# EAGLE design Tic-tac-toe game (EAGLE 9.6.2)
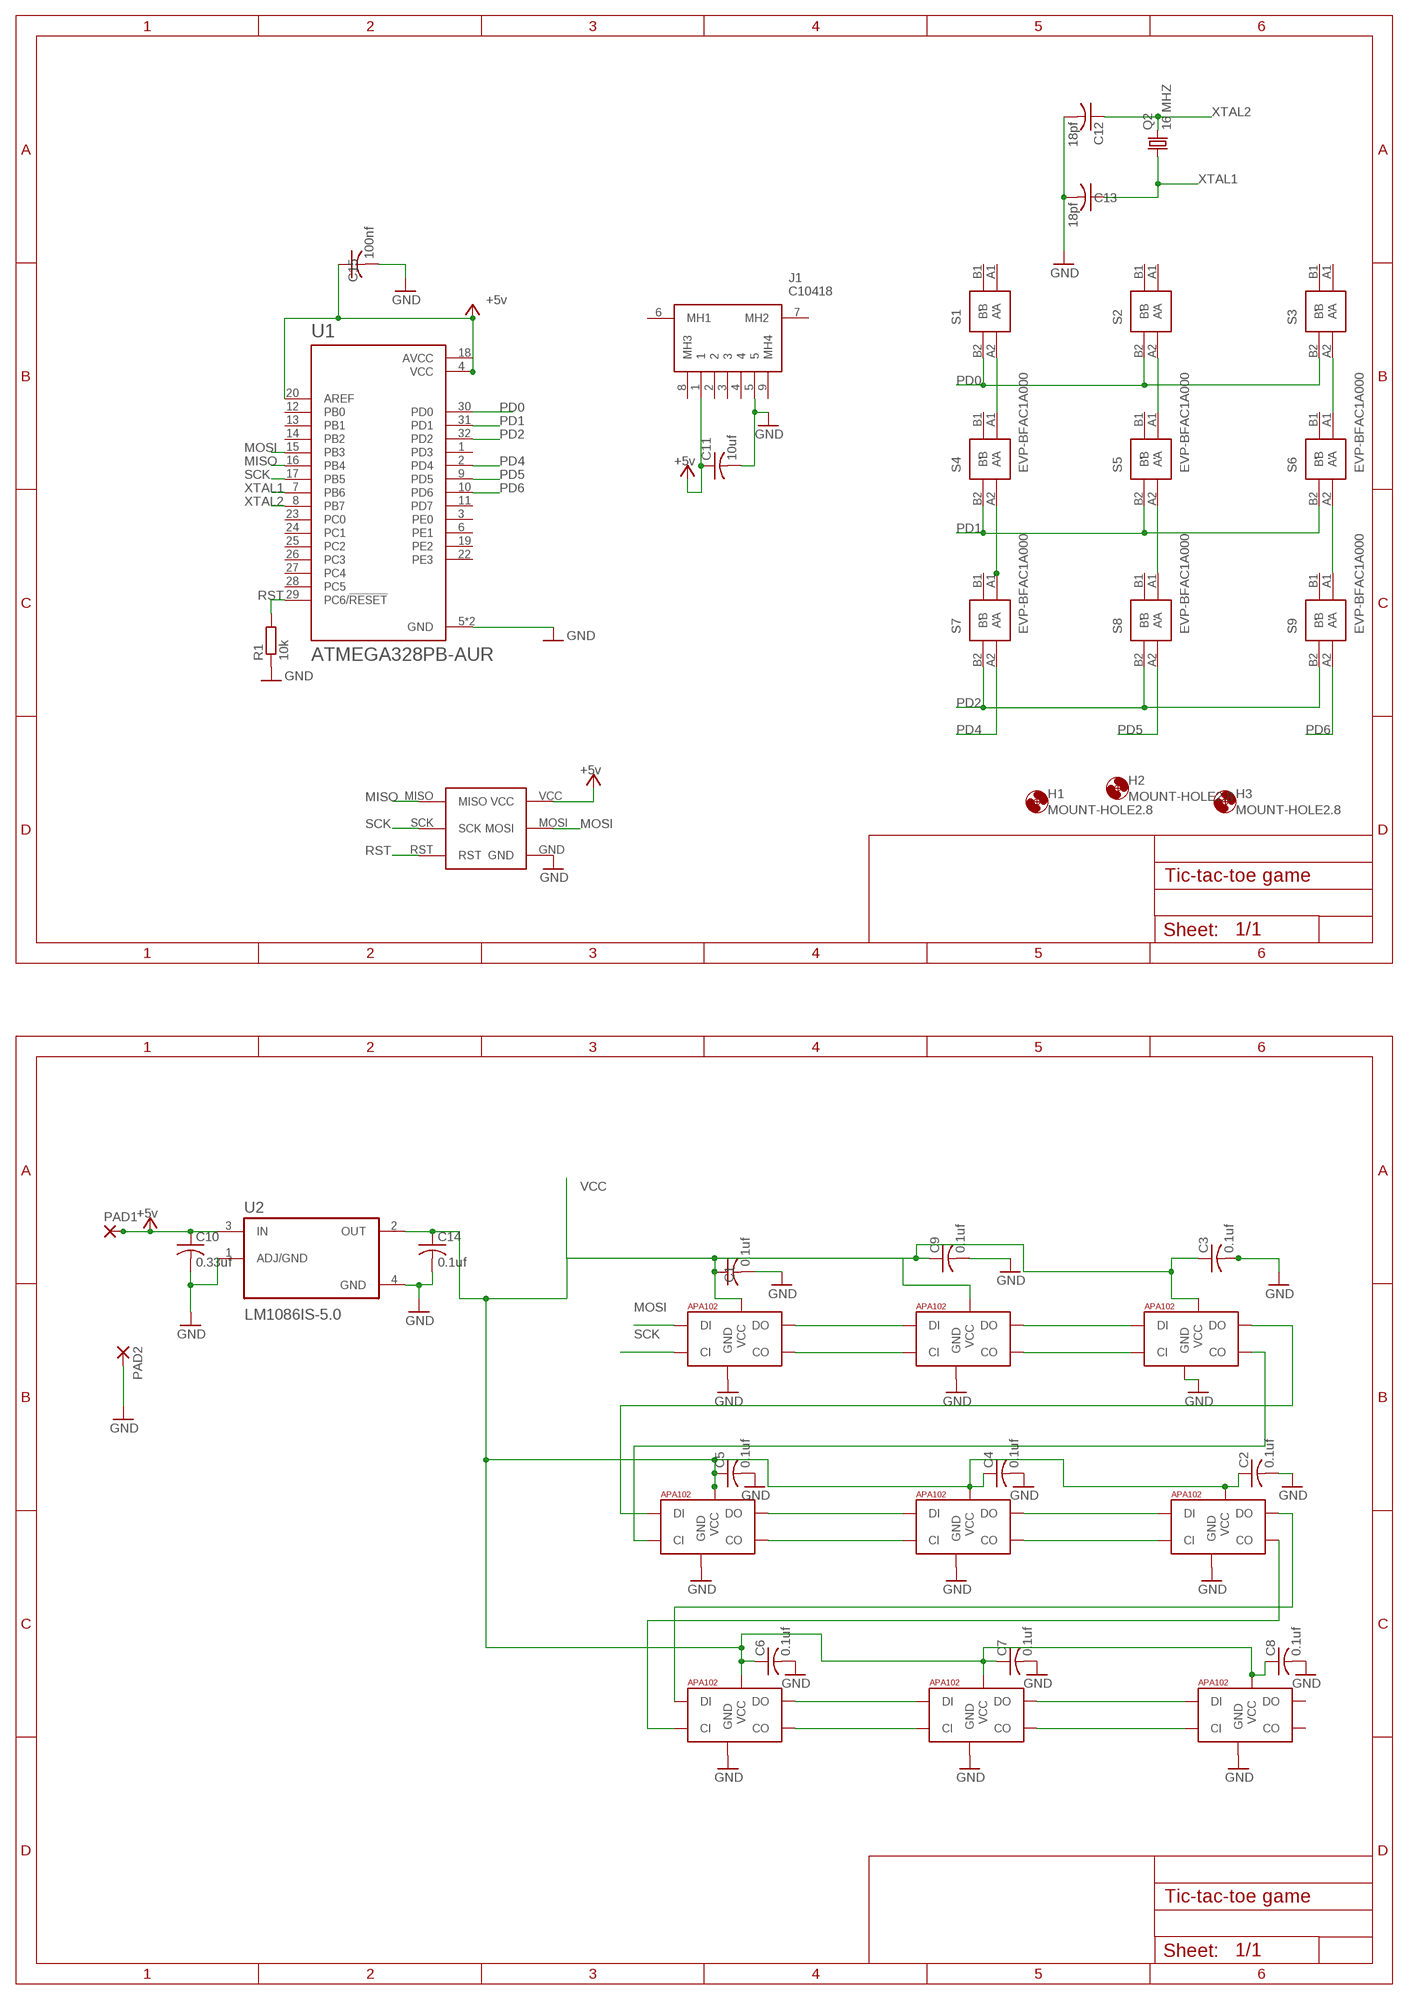
[diagram p0: schematic, sheet 1]

## Parts
C1  0.1uf  C-USC0805  [C0805]
C2  0.1uf  C-USC0805  [C0805]
C3  0.1uf  C-USC0805  [C0805]
C4  0.1uf  C-USC0805  [C0805]
C5  0.1uf  C-USC0805  [C0805]
C6  0.1uf  C-USC0805  [C0805]
C7  0.1uf  C-USC0805  [C0805]
C8  0.1uf  C-USC0805  [C0805]
C9  0.1uf  C-USC0805  [C0805]
C10  0.33uf  C-USC0805  [C0805]
C11  10uf  C-USC0805  [C0805]
C12  18pf  C-USC0805  [C0805]
C13  18pf  C-USC0805  [C0805]
C14  0.1uf  C-USC0805  [C0805]
C15  100nf  C-USC0805  [C0805]
H1  MOUNT-HOLE2.8  [2,8]
H2  MOUNT-HOLE2.8  [2,8]
H3  MOUNT-HOLE2.8  [2,8]
J1  C10418  [C10418]
PAD1  2,15/1,0  [2,15/1,0]
PAD2  2,15/1,0  [2,15/1,0]
Q2  16 MHZ  CRYSTALHC49UP  [HC49UP]
R1  10k  R-EU_M0805  [M0805]
S1  EVP-BFAC1A000  [EVPBFAC1A000]
S2  EVP-BFAC1A000  [EVPBFAC1A000]
S3  EVP-BFAC1A000  [EVPBFAC1A000]
S4  EVP-BFAC1A000  [EVPBFAC1A000]
S5  EVP-BFAC1A000  [EVPBFAC1A000]
S6  EVP-BFAC1A000  [EVPBFAC1A000]
S7  EVP-BFAC1A000  [EVPBFAC1A000]
S8  EVP-BFAC1A000  [EVPBFAC1A000]
S9  EVP-BFAC1A000  [EVPBFAC1A000]
U1  ATMEGA328PB-AUR  [QFP80P900X900X120-32N]
U2  LM1086IS-5.0  [TO254P1524X483-4N]
U$1  AVR-ISP  [AVR-ISP]
U$2  APA1025050  [APA102_5050]
U$3  APA1025050  [APA102_5050]
U$4  APA1025050  [APA102_5050]
U$5  APA1025050  [APA102_5050]
U$6  APA1025050  [APA102_5050]
U$7  APA1025050  [APA102_5050]
U$8  APA1025050  [APA102_5050]
U$9  APA1025050  [APA102_5050]
U$10  APA1025050  [APA102_5050]

## Nets
GND: C1.2 C2.2 C3.2 C4.2 C5.2 C6.2 C7.2 C8.2 C9.2 C10.2 C11.2 C12.2 C13.2 C14.2 C15.2 J1.5 PAD2.1(P) R1.1 U1.5(GND) U1.21(GND) U2.1(ADJ/GND) U2.4(GND) U$1.GND U$2.6(GND) U$3.6(GND) U$4.6(GND) U$5.6(GND) U$6.6(GND) U$7.6(GND) U$8.6(GND) U$9.6(GND) U$10.6(GND)
MISO: U1.16(PB4) U$1.MISO
MOSI: U1.15(PB3) U$1.MOSI U$2.4(DI)
N$4: C10.1 PAD1.1(P) U2.3(IN) ; supply symbol labelled +5v
N$5: U$2.3(DO) U$3.4(DI)
N$6: U$2.2(CO) U$3.5(CI)
N$7: U$3.3(DO) U$4.4(DI)
N$8: U$3.2(CO) U$4.5(CI)
N$11: U$8.3(DO) U$9.4(DI)
N$15: S1.A2(A') S4.A1(A)
N$16: S6.A2(A') S9.A1(A)
N$19: S4.A2(A') S7.A1(A)
N$23: S2.A2(A') S5.A1(A)
N$24: S5.A2(A') S8.A1(A)
N$26: S3.A2(A') S6.A1(A)
N$34: U$4.3(DO) U$5.4(DI)
N$35: U$4.2(CO) U$5.5(CI)
N$36: U$5.3(DO) U$6.4(DI)
N$37: U$5.2(CO) U$6.5(CI)
N$38: U$6.3(DO) U$7.4(DI)
N$39: U$6.2(CO) U$7.5(CI)
N$40: U$8.2(CO) U$9.5(CI)
N$41: U$9.3(DO) U$10.4(DI)
N$42: U$9.2(CO) U$10.5(CI)
N$46: U$7.2(CO) U$8.5(CI)
N$47: U$7.3(DO) U$8.4(DI)
PD0: S1.B2(B') S2.B2(B') S3.B2(B') U1.30(PD0)
PD1: S4.B2(B') S5.B2(B') S6.B2(B') U1.31(PD1)
PD2: S7.B2(B') S8.B2(B') S9.B2(B') U1.32(PD2)
PD4: S7.A2(A') U1.2(PD4)
PD5: S8.A2(A') U1.9(PD5)
PD6: S9.A2(A') U1.10(PD6)
RST: R1.2 U1.29(PC6/!RESET) U$1.RST
SCK: U1.17(PB5) U$1.SCK U$2.5(CI)
VCC: C1.1 C2.1 C3.1 C4.1 C5.1 C6.1 C7.1 C8.1 C9.1 C11.1 C14.1 C15.1 J1.1 U1.4(VCC) U1.18(AVCC) U1.20(AREF) U2.2(OUT) U$1.VCC U$2.1(VCC) U$3.1(VCC) U$4.1(VCC) U$5.1(VCC) U$6.1(VCC) U$7.1(VCC) U$8.1(VCC) U$9.1(VCC) U$10.1(VCC) ; supply symbol labelled +5v
XTAL1: C13.1 Q2.1 U1.7(PB6)
XTAL2: C12.1 Q2.2 U1.8(PB7)
Unconnected: J1.2 J1.3 J1.4 J1.6(MH1) J1.7(MH2) J1.8(MH3) J1.9(MH4) S1.A1(A) S1.B1(B) S2.A1(A) S2.B1(B) S3.A1(A) S3.B1(B) S4.B1(B) S5.B1(B) S6.B1(B) S7.B1(B) S8.B1(B) S9.B1(B) U1.1(PD3) U1.3(PE0) U1.6(PE1) U1.11(PD7) U1.12(PB0) U1.13(PB1) U1.14(PB2) U1.19(PE2) U1.22(PE3) U1.23(PC0) U1.24(PC1) U1.25(PC2) U1.26(PC3) U1.27(PC4) U1.28(PC5) U$10.2(CO) U$10.3(DO)

## Library data of the parts
C1-C15 = rcl:C-US: CAPACITOR, American symbol; SPICEPREFIX: C
H1-H3 = holes:MOUNT-HOLE: MOUNTING HOLE with drill center marker
J1 = C10418:C10418: USB Connectors SMD RoHS Source: Datasheet <https://datasheet.lcsc.com/szlcsc/Jing-Extension-of-the-Electronic-Co-LCSC-MICRO-USB-5S-B-Type-horns-High-temperature_C10418.pdf>; DESCRIPTION: USB Connectors SMD RoHS; HEIGHT: 3mm; MANUFACTURER_NAME: Jing Extension of the Electronic Co.; MANUFACTURER_PART_NUMBER: C10418
PAD1 PAD2 = wirepad:2,15/1,0: THROUGH-HOLE PAD
Q2 = crystal:CRYSTAL: CRYSTAL; OC_FARNELL: unknown; OC_NEWARK: unknown
R1 = rcl:R-EU_: RESISTOR, European symbol; SPICEPREFIX: R
S1-S9 = EVP-BFAC1A000:EVP-BFAC1A000: Tactile Switches 6.0x6.0x3.4mm 2N w/4 Term .25mm Trvl IP67 Source: Datasheet <https://industrial.panasonic.com/cdbs/www-data/pdf/ATK0000/ATK0000C432.pdf> Check prices <https://pricing.snapeda.com/parts/EVP-BFAC1A000/Panasonic%20Electronic/view-part?ref=eda>; AVAILABILITY: Warning; DESCRIPTION: Tactile Switch SPST-NO Top Actuated Surface Mount; MF: Panasonic Electronic; MP: EVP-BFAC1A000; PACKAGE: None; PRICE: None; PURCHASE-URL: https://pricing.snapeda.com/search/part/EVP-BFAC1A000/?ref=eda
U1 = ATMEGA328PB-AUR:ATMEGA328PB-AUR: ATmega Series 20 MHz 32 KB Flash 2 KB SRAM 8-Bit Microcontroller - TQFP-32; DESCRIPTION: AVR AVR® ATmega Microcontroller IC 8-Bit 20MHz 32KB (16K x 16) FLASH 32-TQFP (7x7); DIGI-KEY_PART_NUMBER: ATMEGA328PB-AURCT-ND; MF: Microchip; MP: ATMEGA328PB-AUR; PACKAGE: TQFP-32 Microchip; PURCHASE-URL: https://pricing.snapeda.com/search/part/ATMEGA328PB-AUR/?ref=eda
U2 = LM1086IS-5.0:LM1086IS-5.0: Check prices <https://pricing.snapeda.com/search/part/LM1086IS-5.0/NOPB/?ref=eda>; AVAILABILITY: Good; DESCRIPTION: 1.5-A, 29-V, linear voltage regulator 3-DDPAK/TO-263 -40 to 125; MF: Texas Instruments; MP: LM1086IS-5.0/NOPB; PACKAGE: TO-263-3 Texas Instruments; PRICE: None; PURCHASE-URL: https://pricing.snapeda.com/search/part/LM1086IS-5.0/NOPB/?ref=eda
U$1 = AVR-ISP:AVR-ISP: Check prices <https://pricing.snapeda.com/search/part/AVR-ISP/?ref=eda>; AVAILABILITY: Bad; DESCRIPTION: Emulators / Simulators AVR USB IN CIRCUIT EMUL/PRGMR ISP; MF: Gravitech; MP: AVR-ISP; PACKAGE: None; PRICE: None
U$2-U$10 = jos-ph:APA102: APA102C 5050 RGB LED -- Adafruit DotStar Single LED Pixel Product Page: https://www.adafruit.com/products/2343 Datasheet: https://cdn-shop.adafruit.com/product-files/2343/APA102C.pdf

## Board
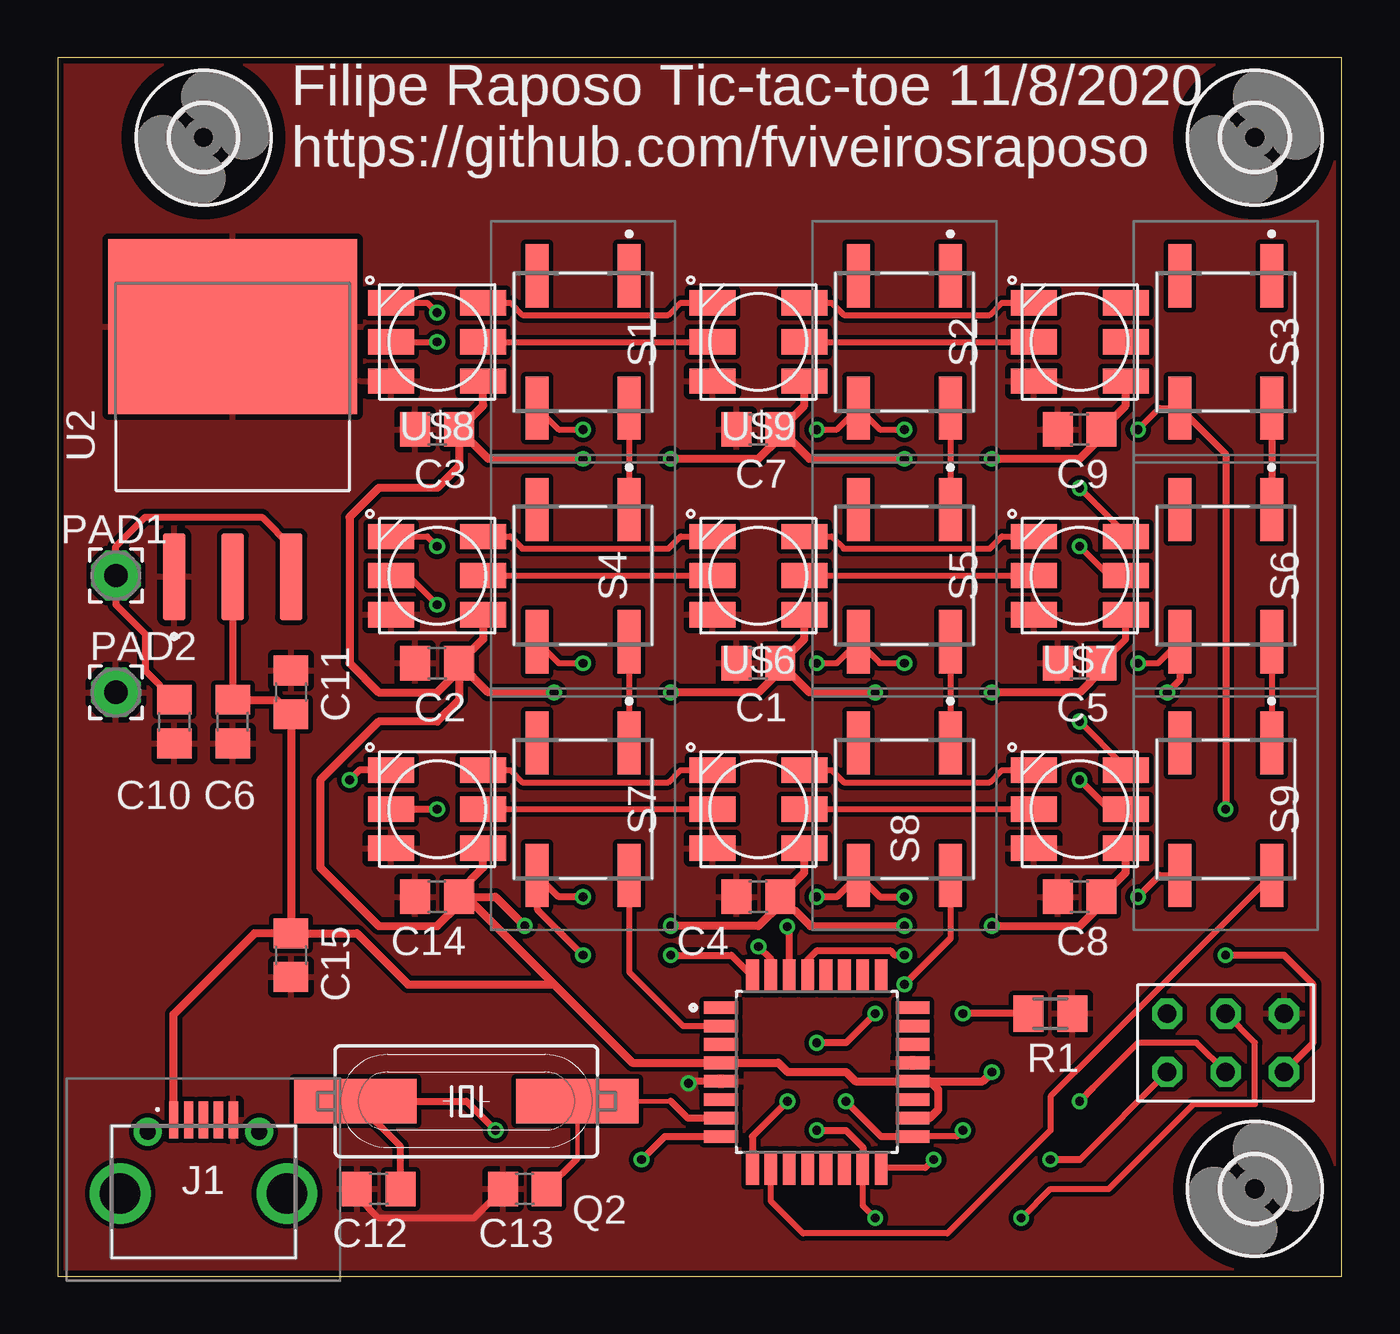
[diagram p1: board, top side]
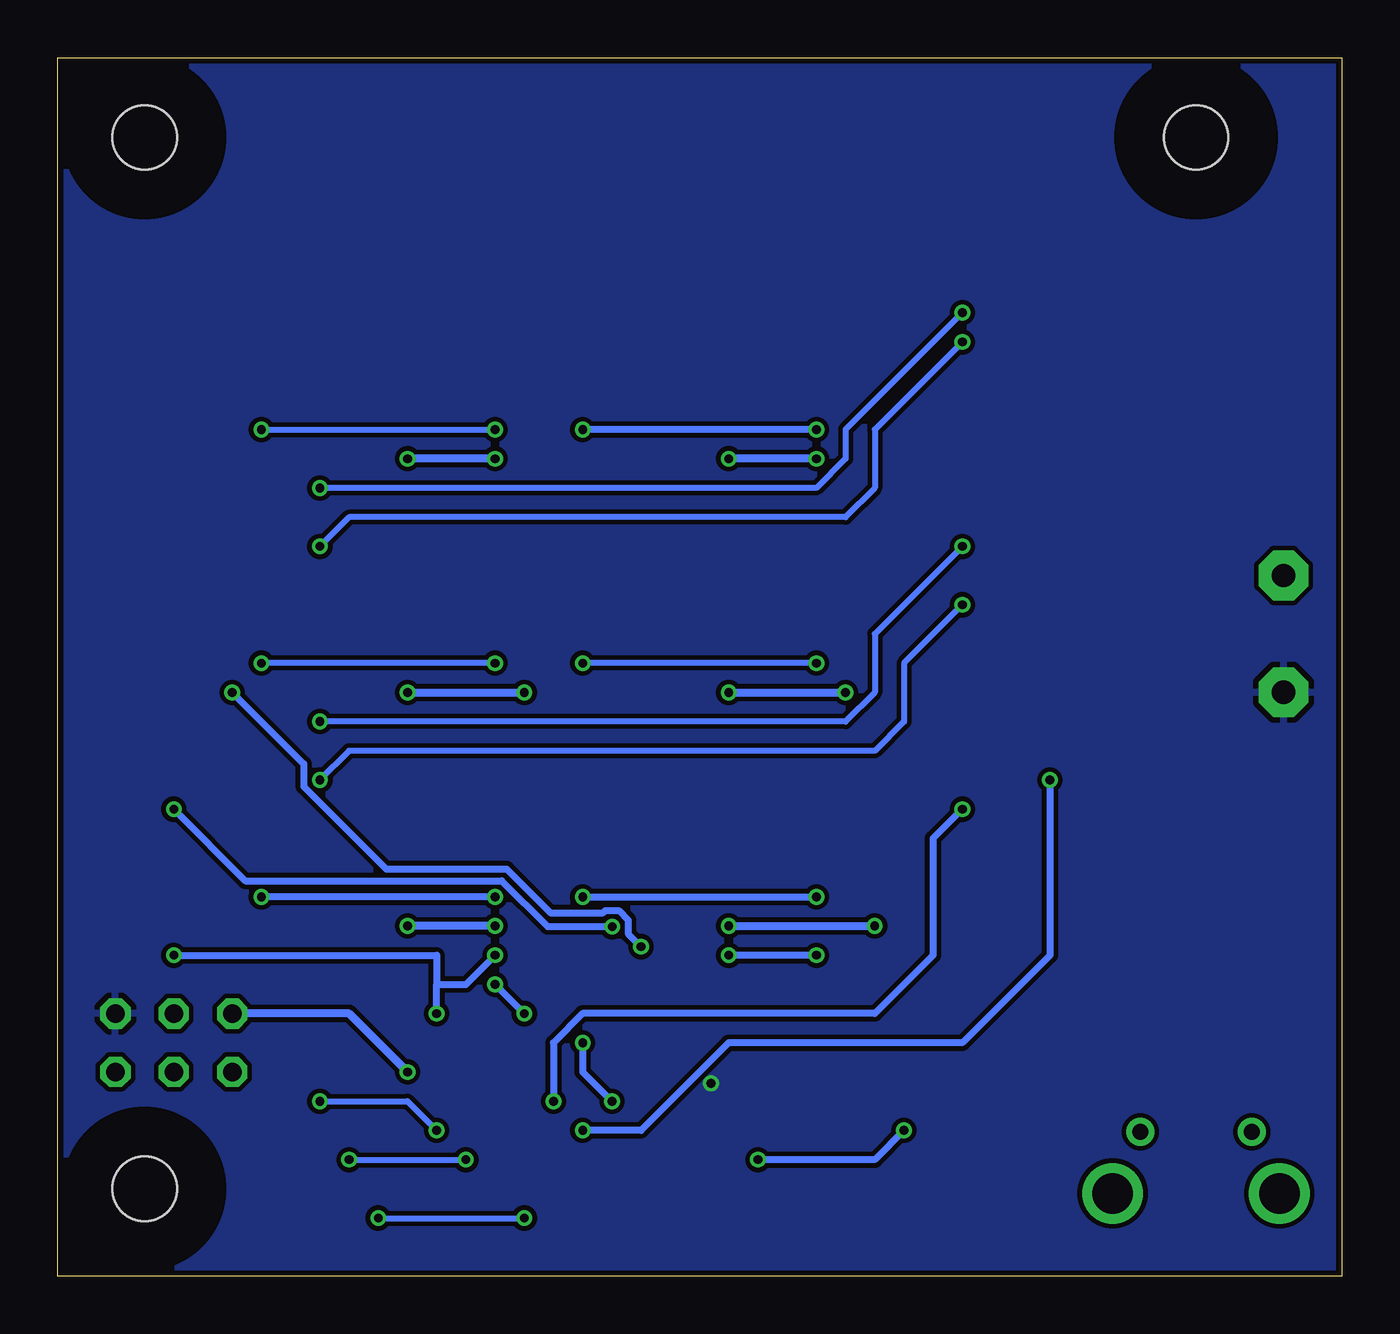
[diagram p2: board, bottom side, seen from below]

Size 55.86 x 53.01 mm. Coordinates in mm from the lower left corner, seen from the top.
Outline: 0,0 55.86,0 55.86,53.01 0,53.01 0,0
Copper layers (1*16): Top 0.035mm / dielectric 1.5mm / Bottom 0.035mm
Design rules "Dirty8TS": minimum track width 8mil, minimum drill 15mil, track to track 8mil, track to pad 8mil, pad to pad 8mil, via to via 8mil, smd to smd 0mil, copper to edge 10mil, drill to drill 10mil, minimum pad ring 10mil, minimum via ring 6mil, stop-mask expansion 2mil, vias tented up to drill 25mil, thermal gap 10mil

### Footprints (pad centres in the part's own frame; a part is rotated, then mirrored left to right if it is on the bottom)
C0805 = smd 1.3 x 1.5: 1 -0.95,0; 2 0.95,0
2,8 = hole 2.8: 0,0
C10418 = smd 0.4 x 1.6: 1 1.3,-3; 2 0.65,-3; 3 0,-3; 4 -0.65,-3; 5 -1.3,-3 | drill 1.76 pad 2.64: 6 -3.625,0.2; 7 3.625,0.2 | drill 0.7 pad 1.2: 8 -2.425,-2.48; 9 2.425,-2.48
2,15/1,0 = drill 1.016 pad 2.159 octagon: 1 0,0
HC49UP = smd 5.334 x 1.93: 1 -4.826,0; 2 4.826,0
M0805 = smd 1.3 x 1.6: 1 -0.95,0; 2 0.95,0
EVPBFAC1A000 = smd 2.75 x 1: A1 2.875,-2; A2 -2.875,-2; B1 2.875,2; B2 -2.875,2
QFP80P900X900X120-32N = smd 1.47 x 0.55: 1 -4.17,2.8; 2 -4.17,2; 3 -4.17,1.2; 4 -4.17,0.4; 5 -4.17,-0.4; 6 -4.17,-1.2; 7 -4.17,-2; 8 -4.17,-2.8; 17 4.17,-2.8; 18 4.17,-2; 19 4.17,-1.2; 20 4.17,-0.4; 21 4.17,0.4; 22 4.17,1.2; 23 4.17,2; 24 4.17,2.8 | smd 0.55 x 1.47: 9 -2.8,-4.17; 10 -2,-4.17; 11 -1.2,-4.17; 12 -0.4,-4.17; 13 0.4,-4.17; 14 1.2,-4.17; 15 2,-4.17; 16 2.8,-4.17; 25 2.8,4.17; 26 2,4.17; 27 1.2,4.17; 28 0.4,4.17; 29 -0.4,4.17; 30 -1.2,4.17; 31 -2,4.17; 32 -2.8,4.17
TO254P1524X483-4N = smd 3.79 x 0.99: 1 -6.4,2.54; 2 -6.4,0; 3 -6.4,-2.54 | smd 7.62 x 10.84: 4 4.48,0
AVR-ISP = drill 0.8 octagon: GND 2.54,1.27; MISO -2.54,-1.27; MOSI 0,1.27; RST 2.54,-1.27; SCK 0,-1.27; VCC -2.54,1.27
APA102_5050 = smd 2 x 1.1: 1 2,-1.7; 2 2,0; 3 2,1.7; 4 -2,1.7; 5 -2,0; 6 -2,-1.7

### Placement (x,y rotation side)
C1  30.48,26.67 180 top
C2  16.51,26.67 180 top
C3  16.51,36.83 180 top
C4  30.48,16.51 180 top
C5  44.45,26.67 180 top
C6  7.62,24.13 270 top
C7  30.48,36.83 180 top
C8  44.45,16.51 180 top
C9  44.45,36.83 180 top
C10  5.08,24.13 270 top
C11  10.16,25.4 90 top
C12  13.97,3.81 180 top
C13  20.32,3.81 180 top
C14  16.51,16.51 180 top
C15  10.16,13.97 270 top
H1  52.07,3.81 0 top
H2  52.07,49.53 0 top
H3  6.35,49.53 0 top
J1  6.35,3.81 180 top
PAD1  2.54,30.48 0 top
PAD2  2.54,25.4 0 top
Q2  17.78,7.62 180 top
R1  43.18,11.43 180 top
S1  22.86,40.64 90 top
S2  36.83,40.64 90 top
S3  50.8,40.64 90 top
S4  22.86,30.48 90 top
S5  36.83,30.48 90 top
S6  50.8,30.48 90 top
S7  22.86,20.32 90 top
S8  36.83,20.32 90 top
S9  50.8,20.32 90 top
U1  33.02,8.89 0 top
U2  7.62,36.83 90 top
U$1  50.8,10.16 0 top
U$2  16.51,20.32 0 top
U$3  30.48,20.32 0 top
U$4  44.45,20.32 0 top
U$5  16.51,30.48 0 top
U$6  30.48,30.48 0 top
U$7  44.45,30.48 0 top
U$8  16.51,40.64 0 top
U$9  30.48,40.64 0 top
U$10  44.45,40.64 0 top

### Tracks (layer width: path | path; a pad name or v marks a point on that pad's centre or on a via)
GND  (via drill 0.38)
  Top 0.305: C13.2 18.1,2.54 13.97,2.54 13.02,3.49 C12.2 | U1.5 27.54,8.49 v27.45,8.4
  pour Top: 0.32,53.56 55.88,53.56 55.88,0 0.32,0
  pour Bottom: 0,53.34 0,0 55.88,0 55.88,53.34
MISO  (via drill 0.38)
  Top 0.254: v38.1,5.08 37.74,4.72 U1.16 | U$1.MISO 44.45,5.08
  Top 0.305: 44.45,5.08 v43.18,5.08
  Bottom 0.254: v43.18,5.08 v38.1,5.08
MOSI  (via drill 0.38)
  Top 0.254: U$1.MOSI 52.07,10.16 52.07,7.5 49.41,7.5 45.72,3.81 43.18,3.81 v41.91,2.54 | v35.56,2.54 35.02,3.08 U1.15
  Top 0.305: U$2.4 13.13,22.02 v12.7,21.59 | v33.02,6.35 34.29,6.35 35.02,5.62 U1.15
  Bottom 0.254: v41.91,2.54 v35.56,2.54
  Bottom 0.305: v12.7,21.59 12.7,13.97 16.51,10.16 26.67,10.16 30.48,6.35 v33.02,6.35
N$4
  Top 0.305: U2.3 10.16,31.75 8.89,33.02 3.81,33.02 2.54,31.75 PAD1.1 2.54,29.21 3.81,27.94 3.81,26.35 C10.1
N$5
  Top 0.254: U$2.3 19.69,22.02 20.22,21.49 26.57,21.49 27.1,22.02 U$3.4
N$6
  Top 0.254: U$2.2 U$3.5
N$7
  Top 0.254: U$3.3 33.66,22.02 34.19,21.49 40.54,21.49 41.07,22.02 U$4.4
N$8
  Top 0.254: U$3.2 U$4.5
N$11
  Top 0.254: U$8.3 19.69,42.34 20.22,41.81 26.57,41.81 27.1,42.34 U$9.4
N$15
  Top 0.254: S1.A2 S4.A1
N$16
  Top 0.254: S6.A2 S9.A1
N$19
  Top 0.254: S4.A2 S7.A1
N$23
  Top 0.254: S2.A2 S5.A1
N$24
  Top 0.254: S5.A2 S8.A1
N$26
  Top 0.305: S3.A2 S6.A1
N$34  (via drill 0.38)
  Top 0.254: U$5.4 16.08,32.18 v16.51,31.75 | v44.45,24.13 46.36,22.23
  Top 0.305: U$4.3 46.36,22.11 46.36,22.23
  Bottom 0.254: v16.51,31.75 20.32,27.94 20.32,25.4 21.59,24.13 v44.45,24.13
N$35  (via drill 0.38)
  Top 0.254: U$5.5 15.24,30.48 v16.51,29.21
  Top 0.305: v44.45,21.59 45.72,20.32 U$4.2
  Bottom 0.254: v16.51,29.21 19.05,26.67 19.05,24.13 20.32,22.86 43.18,22.86 v44.45,21.59
N$36
  Top 0.254: U$5.3 19.69,32.18 20.22,31.65 26.57,31.65 27.1,32.18 U$6.4
N$37
  Top 0.254: U$5.2 U$6.5
N$38
  Top 0.254: U$6.3 33.66,32.18 34.19,31.65 40.54,31.65 41.07,32.18 U$7.4
N$39
  Top 0.254: U$6.2 U$7.5
N$40
  Top 0.254: U$8.2 U$9.5
N$41
  Top 0.254: U$9.3 33.66,42.34 34.19,41.81 40.54,41.81 41.07,42.34 U$10.4
N$42
  Top 0.254: U$9.2 U$10.5
N$46  (via drill 0.38)
  Top 0.254: U$8.5 v16.51,40.64 | v44.45,31.75 45.72,30.48 U$7.2
  Bottom 0.254: v16.51,40.64 20.32,36.83 20.32,34.29 21.59,33.02 43.18,33.02 v44.45,31.75
N$47  (via drill 0.38)
  Top 0.254: U$7.3 46.56,32.18 v44.45,34.29 | U$8.4 16.08,42.34 v16.51,41.91
  Bottom 0.254: v16.51,41.91 21.59,36.83 21.59,35.56 22.86,34.29 v44.45,34.29
PD0  (via drill 0.38)
  Top 0.254: v36.83,36.83 35.77,36.83 S2.B2 33.89,36.83 v33.02,36.83 | v46.99,36.83 47.92,37.77 S3.B2 | S1.B2 21.79,36.83 v22.86,36.83
  Top 0.305: S3.B2 50.8,35.77 v50.8,20.32 | v31.74,15.21 31.82,15.13 U1.30
  Bottom 0.254: v46.99,36.83 v36.83,36.83
  Bottom 0.305: v50.8,20.32 47.69,17.21 36.54,17.21 34.55,15.21 v31.74,15.21 | v22.86,36.83 v33.02,36.83
PD1  (via drill 0.38)
  Top 0.254: S4.B2 21.79,26.67 v22.86,26.67 | v33.02,26.67 33.89,26.67 S5.B2 35.77,26.67 v36.83,26.67 | v46.99,26.67 47.86,26.67 S6.B2
  Top 0.305: S6.B2 48.8,25.94 v48.26,25.4 | v30.48,14.34 31.02,13.8 U1.31
  Bottom 0.254: v22.86,26.67 v33.02,26.67 | v36.83,26.67 v46.99,26.67
  Bottom 0.305: v48.26,25.4 45.15,22.29 45.15,21.3 41.56,17.72 36.33,17.72 34.42,15.81 32.13,15.81 32.03,15.91 31.45,15.91 31.04,15.5 31.04,14.9 v30.48,14.34
PD2  (via drill 0.38)
  Top 0.305: v33.02,16.51 33.89,16.51 S8.B2 35.77,16.51 v36.83,16.51 | v22.86,16.51 21.79,16.51 S7.B2 20.86,15.97 v22.86,13.97 | v46.99,16.51 47.92,17.45 S9.B2 | v26.67,13.97 29.31,13.97 U1.32
  Bottom 0.305: v33.02,16.51 v22.86,16.51 | v36.83,16.51 v46.99,16.51 | v22.86,13.97 v26.67,13.97
PD4
  Top 0.254: S7.A2 24.86,13.24 27.21,10.89 U1.2
PD5  (via drill 0.38)
  Top 0.254: S8.A2 38.83,14.7
  Top 0.305: 38.83,14.7 v36.83,12.7 | v31.75,7.62 30.22,6.09 U1.9 | v35.56,11.43 34.29,10.16 v33.02,10.16
  Bottom 0.305: v36.83,12.7 v35.56,11.43 | v33.02,10.16 33.02,8.89 v31.75,7.62
PD6
  Top 0.254: U1.10 31.02,3.27 32.42,1.87 38.7,1.87 43.18,6.35 43.18,7.83 44.25,8.89 44.35,8.99 S9.A2
RST  (via drill 0.38)
  Top 0.305: U$1.RST 54.61,10.16 54.61,12.7 53.34,13.97 v50.8,13.97 | v36.83,13.97 36.42,13.97 36.24,14.15 33,14.15 32.62,13.77 U1.29 | R1.2 v39.37,11.43
  Bottom 0.305: 39.37,12.7 38.1,12.7 v36.83,13.97 | v39.37,11.43 39.37,12.7 | 39.37,12.7 39.37,13.97 v50.8,13.97
SCK  (via drill 0.38)
  Top 0.254: v39.37,6.35 39.11,6.09 U1.17 | U$1.SCK 49.53,10.16 46.99,10.16 45.02,8.19
  Top 0.305: U$2.5 v16.51,20.32 | v34.29,7.62 35.82,6.09 U1.17 | 45.02,8.19 v44.45,7.62
  Bottom 0.254: v44.45,7.62 40.64,7.62 v39.37,6.35
  Bottom 0.305: v16.51,20.32 17.78,19.05 17.78,13.97 20.32,11.43 33.02,11.43 34.29,10.16 v34.29,7.62
VCC  (via drill 0.38)
  Top 0.254: 45.37,36.83 C9.1
  Top 0.305: 45.4,16.19 C8.1 | C2.1 17.62,26.51 | 17.62,26.51 18.73,25.4 | 31.59,26.51 C1.1 | C5.1 46.45,27.72 U$7.1 | 45.37,36.48 45.37,36.83 | 17.62,26.51 16.51,25.4 | C14.1 17.46,16.19 | C7.1 31.43,36.51 | U2.2 7.62,25.4 | C6.1
  Top 0.356: J1.1 5.05,11.4 8.57,14.92 C15.1 | C6.1 7.62,25.4 | C14.1 17.78,16.51 21.59,12.7 | C15.1 13.02,14.92 15.24,12.7 21.59,12.7 | C6.1 9.53,25.08 C11.1 C15.1 | 21.59,12.7 25,9.29 U1.4 31.35,9.29 31.75,8.89 34.29,8.89 34.69,8.49 U1.20 | U1.18 37.94,6.89 38.31,7.26 38.31,8.12 37.94,8.49 U1.20 | U1.20 40.24,8.49 v40.64,8.89 | C3.1 18.51,37.88 U$8.1 | C3.1 17.46,35.24 16.51,34.29 13.97,34.29 12.7,33.02 12.7,26.67 13.97,25.4 16.51,25.4 17.46,26.35 C2.1 | C2.1 18.51,27.72 U$5.1 | C2.1 17.46,25.08 16.51,24.13 13.97,24.13 11.43,21.59 11.43,17.78 13.97,15.24 16.51,15.24 17.46,16.19 | C14.1 17.46,16.73 18.51,17.78 U$2.1 | C14.1 19.05,16.51 v20.32,15.24 | C4.1 32.48,17.56 U$3.1 | C4.1 31.43,16.19 30.48,15.24 v26.67,15.24 | C4.1 32,15.94 32.04,15.94 32.74,15.24 v36.83,15.24 | v40.64,15.24 44.45,15.24 45.4,16.19 | C8.1 46.45,17.56 U$4.1 | C5.1 45.4,26.35 44.45,25.4 v40.64,25.4 | v35.56,25.4 32.7,25.4 31.59,26.51 | U$6.1 32.48,27.72 C1.1 31.43,26.35 30.48,25.4 v26.67,25.4 | v21.59,25.4 18.73,25.4 C2.1 | C3.1 18.73,35.56 v22.86,35.56 | v26.67,35.56 30.48,35.56 31.43,36.51 | U$9.1 32.48,37.88 C7.1 32.7,35.56 v36.83,35.56 | v40.64,35.56 44.45,35.56 45.37,36.48 | C9.1 46.45,37.88 U$10.1
  Bottom 0.356: v40.64,8.89 43.18,11.43 U$1.VCC | v26.67,15.24 v20.32,15.24 | v36.83,15.24 v40.64,15.24 | v40.64,25.4 v35.56,25.4 | v26.67,25.4 v21.59,25.4 | v22.86,35.56 v26.67,35.56 | v36.83,35.56 v40.64,35.56
XTAL1
  Top 0.203: 22.61,5.15 Q2.1 26.67,7.62
  Top 0.305: C13.1 22.61,5.15 | 26.67,7.62 27.4,6.89 U1.7
XTAL2  (via drill 0.38)
  Top 0.305: C12.1 14.92,5.65 Q2.2 17.78,7.62 v19.05,6.35 | v25.4,5.08 26.41,6.09 U1.8
  Bottom 0.305: v19.05,6.35 20.32,5.08 v25.4,5.08

### Text on the board
tPlace: Filipe Raposo Tic-tac-toe 11/8/2020 / https://github.com/fviveirosraposo